# EAGLE design rc2014_8085 (EAGLE 8.1.1)
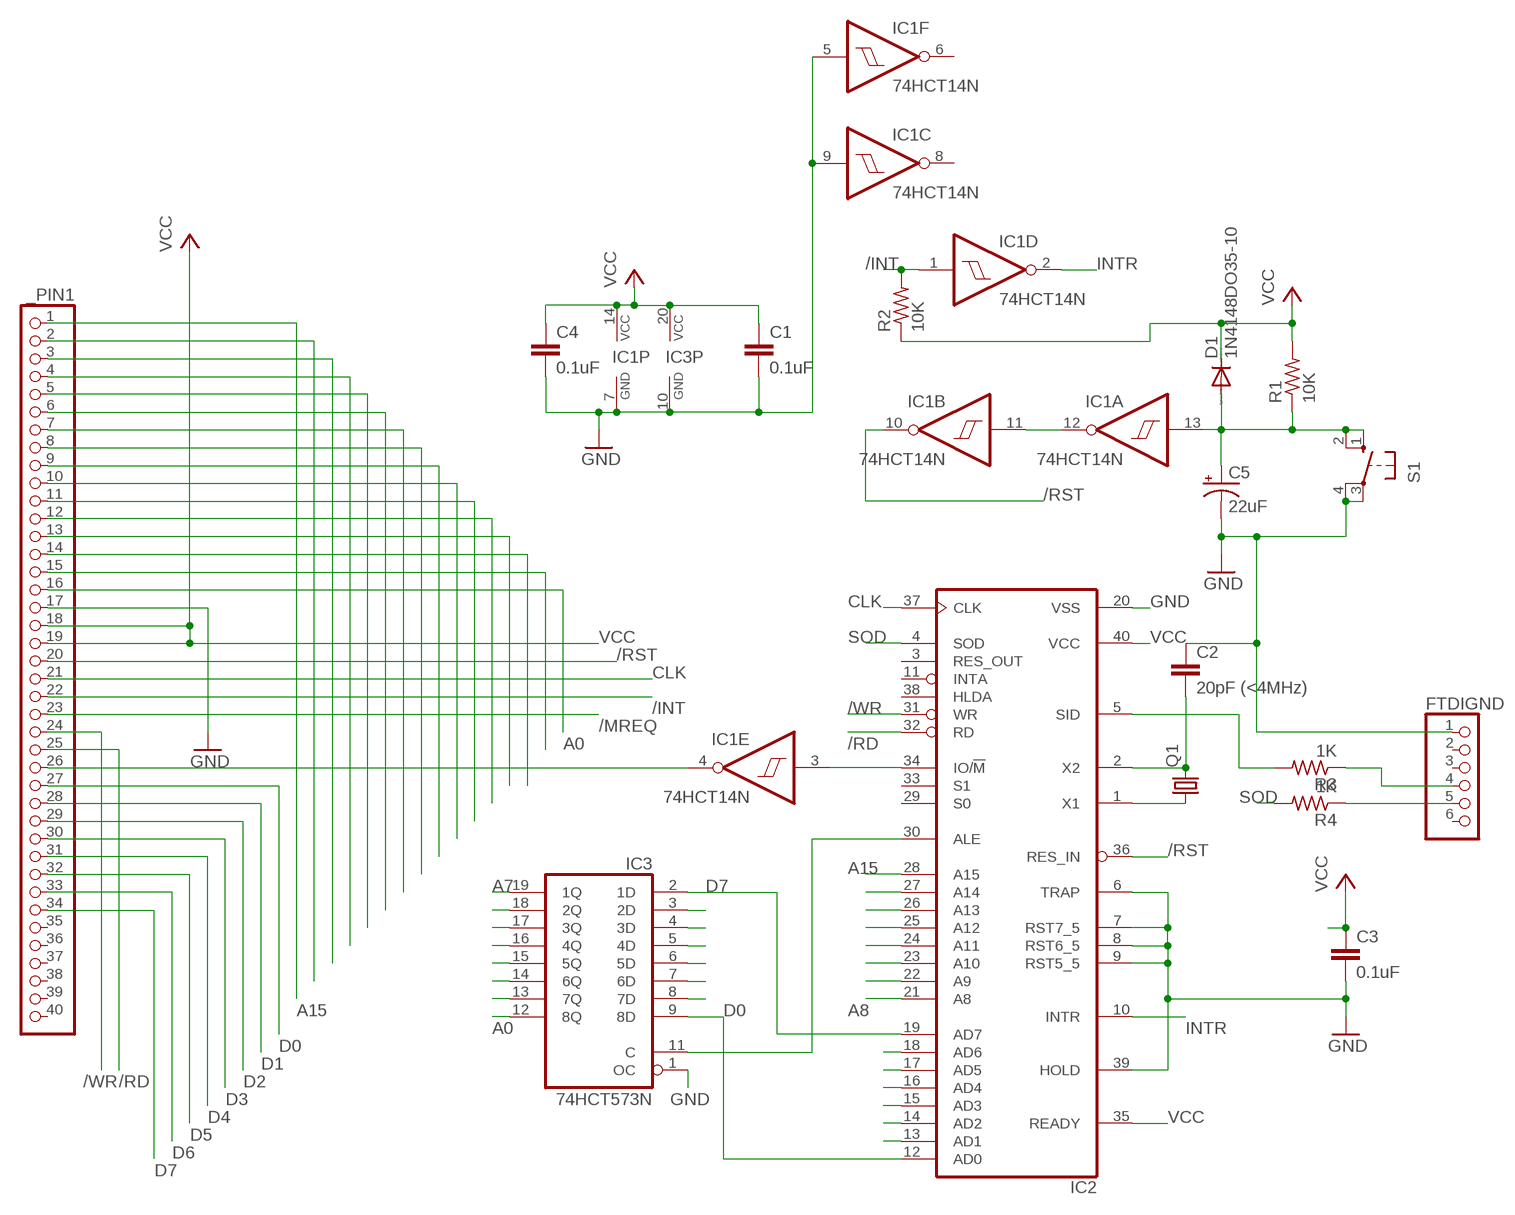
[diagram p0: schematic, sheet 1]

## Parts
_PIN1  PINHD-1X40  [1X40]
C1  0.1uF  C-EU050-024X044  [C050-024X044]
C2  20pF (<4MHz)  C-EU050-024X044  [C050-024X044]
C3  0.1uF  C-EU050-024X044  [C050-024X044]
C4  0.1uF  C-EU050-024X044  [C050-024X044]
C5  22uF  CPOL-USTAP5-80  [TAP5-80]
D1  1N4148DO35-10  [DO35-10]
FTDIGND  PINHD-1X6  [1X06]
IC1  74HCT14N  [DIL14]
IC2  8085  [DIL40]
IC3  74HCT573N  [DIL20]
Q1  CRYSTALHC49S  [HC49/S]
R1  10K  R-US_0207/10  [0207/10]
R2  10K  R-US_0207/10  [0207/10]
R3  1K  R-US_0207/10  [0207/10]
R4  1K  R-US_0207/10  [0207/10]
S1  10-XX  [B3F-10XX]

## Nets
/INT: _PIN1.22 IC1.1(D:I) R2.2
/IORQ: _PIN1.26 IC1.4(E:O)
/MREQ: _PIN1.23 IC1.3(E:I) IC2.34(IO/!M)
/RD: _PIN1.25 IC2.32(RD)
/RST: _PIN1.20 IC1.10(B:O) IC2.36(RES_IN)
/WR: _PIN1.24 IC2.31(WR)
A0: _PIN1.16 IC3.12(8Q)
A1: _PIN1.15 IC3.13(7Q)
A2: _PIN1.14 IC3.14(6Q)
A3: _PIN1.13 IC3.15(5Q)
A4: _PIN1.12 IC3.16(4Q)
A5: _PIN1.11 IC3.17(3Q)
A6: _PIN1.10 IC3.18(2Q)
A7: _PIN1.9 IC3.19(1Q)
A8: _PIN1.8 IC2.21(A8)
A9: _PIN1.7 IC2.22(A9)
A10: _PIN1.6 IC2.23(A10)
A11: _PIN1.5 IC2.24(A11)
A12: _PIN1.4 IC2.25(A12)
A13: _PIN1.3 IC2.26(A13)
A14: _PIN1.2 IC2.27(A14)
A15: _PIN1.1 IC2.28(A15)
ALE: IC2.30(ALE) IC3.11(C)
CLK: _PIN1.21 IC2.37(CLK)
D0: _PIN1.27 IC2.12(AD0) IC3.9(8D)
D1: _PIN1.28 IC2.13(AD1) IC3.8(7D)
D2: _PIN1.29 IC2.14(AD2) IC3.7(6D)
D3: _PIN1.30 IC2.15(AD3) IC3.6(5D)
D4: _PIN1.31 IC2.16(AD4) IC3.5(4D)
D5: _PIN1.32 IC2.17(AD5) IC3.4(3D)
D6: _PIN1.33 IC2.18(AD6) IC3.3(2D)
D7: _PIN1.34 IC2.19(AD7) IC3.2(1D)
GND: _PIN1.17 C1.2 C2.1 C3.2 C4.2 C5.- FTDIGND.1 IC1.5(F:I) IC1.7(P:GND) IC1.9(C:I) IC2.6(TRAP) IC2.7(RST7_5) IC2.8(RST6_5) IC2.9(RST5_5) IC2.20(VSS) IC2.39(HOLD) IC3.1(OC) IC3.10(GND) S1.3(P) S1.4(P1)
INTR: IC1.2(D:O) IC2.10(INTR)
N$5: IC2.1(X1) Q1.1
N$6: C2.2 IC2.2(X2) Q1.2
N$15: IC1.11(B:I) IC1.12(A:O)
RESET: C5.+ D1.A IC1.13(A:I) R1.1 S1.1(S) S1.2(S1)
RX: FTDIGND.4 R3.1
SID: IC2.5(SID) R3.2
SOD: IC2.4(SOD) R4.2
TX: FTDIGND.5 R4.1
VCC: _PIN1.18 _PIN1.19 C1.1 C3.1 C4.1 D1.C IC1.14(P:VCC) IC2.35(READY) IC2.40(VCC) IC3.20(VCC) R1.2 R2.1
Unconnected: _PIN1.35 _PIN1.36 _PIN1.37 _PIN1.38 _PIN1.39 _PIN1.40 FTDIGND.2 FTDIGND.3 FTDIGND.6 IC1.6(F:O) IC1.8(C:O) IC2.3(RES_OUT) IC2.11(INTA) IC2.29(S0) IC2.33(S1) IC2.38(HLDA)

## Library data of the parts
_PIN1 = pinhead:PINHD-1X40: PIN HEADER
C1-C4 = rcl:C-EU: CAPACITOR, European symbol
C5 = rcl:CPOL-US: POLARIZED CAPACITOR, American symbol
D1 = diode:1N4148: DIODE high speed (Philips)
FTDIGND = pinhead:PINHD-1X6: PIN HEADER
IC1 = 74xx-eu:74*14: Hex schmitt trigger INVERTER
IC2 = micro-intel:8085: MICROCOMPUTER/PERIPHERAL DEVICE; OC_FARNELL: unknown; OC_NEWARK: unknown
IC3 = 74xx-eu:74*573: 8-bit D latch BUS DRIVER
Q1 = crystal:CRYSTAL: CRYSTAL; OC_FARNELL: 1667008; OC_NEWARK: unknown
R1-R4 = rcl:R-US_: RESISTOR, American symbol
S1 = switch-omron:10-XX: OMRON SWITCH; MPN: B3F-1000; OC_FARNELL: 176432; OC_NEWARK: 36M3542

## Net classes
0 +5V: width 0.508 mm

## Board
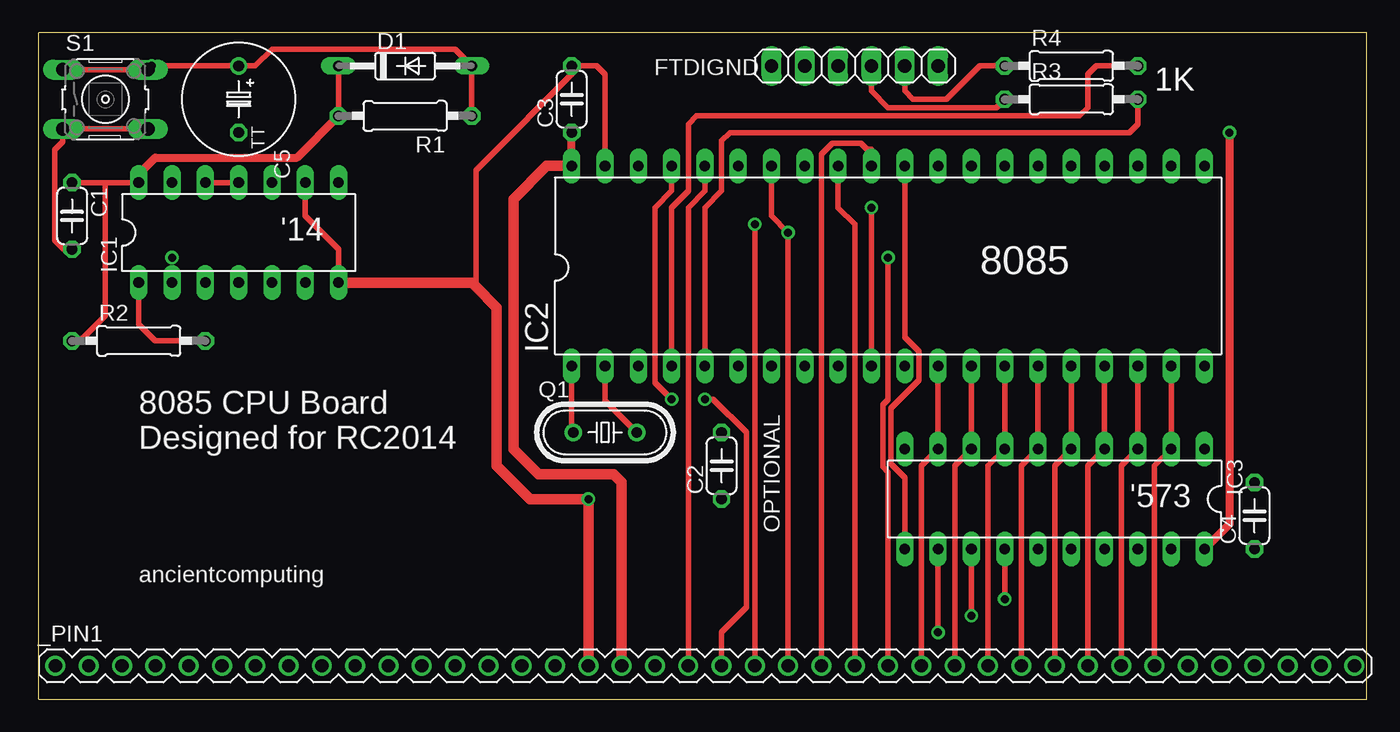
[diagram p1: board, top side]
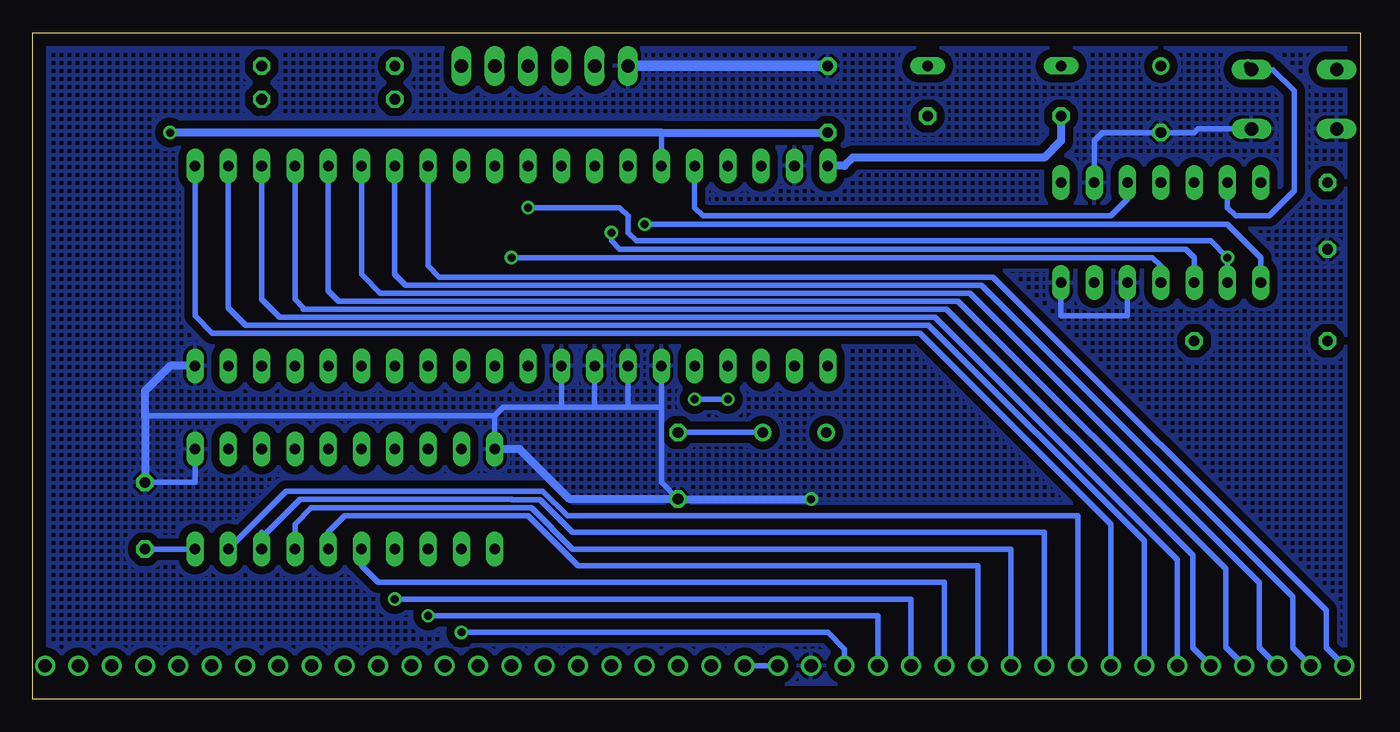
[diagram p2: board, bottom side, seen from below]

Size 101.27 x 50.79 mm. Coordinates in mm from the lower left corner, seen from the top.
Outline: 0,0 101.27,0 101.27,50.79 0,50.79 0,0
Copper layers (1*16): Top 0.035mm / dielectric 1.5mm / Bottom 0.035mm
Design rules "default *": minimum track width 20mil, minimum drill 24mil, track to track 8mil, track to pad 8mil, pad to pad 8mil, via to via 8mil, smd to smd 8mil, copper to edge 40mil, drill to drill 8mil, minimum pad ring 10mil, minimum via ring 8mil, stop-mask expansion 4mil, vias tented up to drill 0mil, thermal gap 10mil

### Footprints (pad centres in the part's own frame; a part is rotated, then mirrored left to right if it is on the bottom)
1X40 = drill 1.016: 1 -49.53,0; 2 -46.99,0; 3 -44.45,0; 4 -41.91,0; 5 -39.37,0; 6 -36.83,0; 7 -34.29,0; 8 -31.75,0; 9 -29.21,0; 10 -26.67,0; 11 -24.13,0; 12 -21.59,0; 13 -19.05,0; 14 -16.51,0; 15 -13.97,0; 16 -11.43,0; 17 -8.89,0; 18 -6.35,0; 19 -3.81,0; 20 -1.27,0; 21 1.27,0; 22 3.81,0; 23 6.35,0; 24 8.89,0; 25 11.43,0; 26 13.97,0; 27 16.51,0; 28 19.05,0; 29 21.59,0; 30 24.13,0; 31 26.67,0; 32 29.21,0; 33 31.75,0; 34 34.29,0; 35 36.83,0; 36 39.37,0; 37 41.91,0; 38 44.45,0; 39 46.99,0; 40 49.53,0
C050-024X044 = drill 0.813 octagon: 1 -2.54,0; 2 2.54,0
TAP5-80 = drill 0.813: + -2.54,0 | drill 0.813 octagon: - 2.54,0
DO35-10 = drill 0.813 long: A 5.08,0; C -5.08,0
1X06 = drill 1.016 long: 1 -6.35,0; 2 -3.81,0; 3 -1.27,0; 4 1.27,0; 5 3.81,0; 6 6.35,0
DIL14 = drill 0.813 long: 1 -7.62,-3.81; 2 -5.08,-3.81; 3 -2.54,-3.81; 4 0,-3.81; 5 2.54,-3.81; 6 5.08,-3.81; 7 7.62,-3.81; 8 7.62,3.81; 9 5.08,3.81; 10 2.54,3.81; 11 0,3.81; 12 -2.54,3.81; 13 -5.08,3.81; 14 -7.62,3.81
DIL40 = drill 0.813 long: 1 -24.13,-7.62; 2 -21.59,-7.62; 3 -19.05,-7.62; 4 -16.51,-7.62; 5 -13.97,-7.62; 6 -11.43,-7.62; 7 -8.89,-7.62; 8 -6.35,-7.62; 9 -3.81,-7.62; 10 -1.27,-7.62; 11 1.27,-7.62; 12 3.81,-7.62; 13 6.35,-7.62; 14 8.89,-7.62; 15 11.43,-7.62; 16 13.97,-7.62; 17 16.51,-7.62; 18 19.05,-7.62; 19 21.59,-7.62; 20 24.13,-7.62; 21 24.13,7.62; 22 21.59,7.62; 23 19.05,7.62; 24 16.51,7.62; 25 13.97,7.62; 26 11.43,7.62; 27 8.89,7.62; 28 6.35,7.62; 29 3.81,7.62; 30 1.27,7.62; 31 -1.27,7.62; 32 -3.81,7.62; 33 -6.35,7.62; 34 -8.89,7.62; 35 -11.43,7.62; 36 -13.97,7.62; 37 -16.51,7.62; 38 -19.05,7.62; 39 -21.59,7.62; 40 -24.13,7.62
DIL20 = drill 0.813 long: 1 -11.43,-3.81; 2 -8.89,-3.81; 3 -6.35,-3.81; 4 -3.81,-3.81; 5 -1.27,-3.81; 6 1.27,-3.81; 7 3.81,-3.81; 8 6.35,-3.81; 9 8.89,-3.81; 10 11.43,-3.81; 11 11.43,3.81; 12 8.89,3.81; 13 6.35,3.81; 14 3.81,3.81; 15 1.27,3.81; 16 -1.27,3.81; 17 -3.81,3.81; 18 -6.35,3.81; 19 -8.89,3.81; 20 -11.43,3.81
HC49/S = drill 0.813: 1 -2.413,0; 2 2.413,0
0207/10 = drill 0.813 octagon: 1 -5.08,0; 2 5.08,0
B3F-10XX = drill 1.016 long: 1 -3.251,2.261; 2 3.251,2.261; 3 -3.251,-2.261; 4 3.251,-2.261

### Placement (x,y rotation side)
_PIN1  50.8,2.54 0 top
C1  2.54,36.83 270 top
C2  0.1uF  [C050-024X044]  52.07,17.78 90 top
C3  40.64,45.72 90 top
C4  92.71,13.97 90 top
C5  15.24,45.72 270 top
D1  27.94,48.26 0 top
FTDIGND  62.23,48.26 0 top
IC1  15.24,35.56 0 top
IC2  64.77,33.02 0 top
IC3  77.47,15.24 180 top
Q1  43.18,20.32 0 top
R1  27.94,44.45 180 top
R2  7.62,27.3 0 top
R3  78.74,45.72 0 top
R4  78.74,48.26 0 top
S1  5.08,45.72 0 top

### Tracks (layer width: path | path; a pad name or v marks a point on that pad's centre or on a via)
/INT  (via drill 0.61)
  Top 0.406: _PIN1.22 v54.61,36.2 | IC1.1 7.62,28.57 8.89,27.3 R2.2
  Bottom 0.406: v54.61,36.2 10.16,36.2 7.62,33.66 IC1.1
/IORQ  (via drill 0.61)
  Top 0.406: _PIN1.26 64.77,17.29 64.36,17.7 64.36,22.42 64.77,22.82 v64.77,33.66
  Bottom 0.406: IC1.4 15.24,33.02 15.88,33.66 v64.77,33.66
/MREQ  (via drill 0.61)
  Top 0.406: _PIN1.23 v57.15,35.56 55.88,36.83 IC2.34
  Bottom 0.406: IC1.3 12.7,33.66 13.34,34.29 56.52,34.29 57.15,34.92 v57.15,35.56
/RD
  Top 0.406: _PIN1.25 62.23,36.2 60.96,37.47 IC2.32
/RST
  Top 0.406: _PIN1.20 49.53,37.47 50.8,38.73 IC2.36
  Bottom 0.406: IC1.10 17.78,38.1 19.05,36.83 50.16,36.83 50.8,37.47 IC2.36
/WR
  Top 0.406: _PIN1.24 59.69,41.54 60.52,42.37 62.69,42.37 63.14,41.91 63.5,41.91 IC2.31
A0  (via drill 0.61)
  Top 0.406: v68.58,5.08 IC3.12
  Bottom 0.406: v68.58,5.08 40.64,5.08 39.37,3.81 _PIN1.16
A1  (via drill 0.61)
  Top 0.406: v71.12,6.35 IC3.13
  Bottom 0.406: v71.12,6.35 36.83,6.35 _PIN1.15
A2  (via drill 0.61)
  Top 0.406: v73.66,7.62 IC3.14
  Bottom 0.406: v73.66,7.62 34.29,7.62 _PIN1.14
A3
  Bottom 0.406: IC3.15 76.2,10.16 74.93,8.89 31.75,8.89 _PIN1.13
A4
  Bottom 0.406: IC3.16 78.74,12.7 77.47,13.97 63.5,13.97 59.69,10.16 29.21,10.16 _PIN1.12
A5
  Bottom 0.406: IC3.17 81.28,13.34 80.03,14.58 63.25,14.58 60.1,11.43 26.67,11.43 _PIN1.11
A6
  Bottom 0.406: _PIN1.10 24.13,12.7 60.1,12.7 62.59,15.19 64.72,15.19 64.77,15.24 80.87,15.24 83.82,12.29 IC3.18 83.82,12.7
A7
  Bottom 0.406: IC3.19 81.94,15.85 62.38,15.85 60.51,13.97 21.59,13.97 _PIN1.9
A8
  Bottom 0.406: _PIN1.8 19.05,13.34 33.62,27.9 87.59,27.9 88.9,29.21 IC2.21
A9
  Bottom 0.406: _PIN1.7 16.51,12.06 32.95,28.51 85.03,28.51 86.36,29.84 IC2.22
A10
  Bottom 0.406: _PIN1.6 13.97,10.61 32.48,29.12 82.46,29.12 83.82,30.48 IC2.23
A11
  Bottom 0.406: IC2.24 81.28,30.48 80.64,29.84 80.64,29.73 31.59,29.73 12.8,10.94 12.8,3.91 _PIN1.5
A12
  Bottom 0.406: IC2.25 78.74,31.11 77.96,30.34 30.7,30.34 10.29,9.93 10.29,3.94 _PIN1.4
A13
  Bottom 0.406: _PIN1.3 7.72,3.91 7.72,8.86 29.81,30.95 74.76,30.95 76.2,32.38 IC2.26
A14
  Bottom 0.406: _PIN1.2 5.18,3.91 5.18,7.81 28.93,31.56 72.83,31.56 73.66,32.38 IC2.27
A15
  Bottom 0.406: _PIN1.1 2.64,3.91 2.64,6.77 28.04,32.17 70.27,32.17 71.12,33.02 IC2.28
ALE
  Top 0.406: IC3.11 66.04,16.88 64.97,17.95 64.97,22.16 67.11,24.3 67.11,26.5 66.04,27.57 IC2.30
CLK  (via drill 0.61)
  Top 0.406: IC2.37 48.26,38.73 46.99,37.47 46.99,24.13 v48.26,22.86 | v50.8,22.86 51.44,22.86 53.98,20.32 53.98,6.99 52.07,5.08 _PIN1.21
  Bottom 0.406: v48.26,22.86 v50.8,22.86
D0
  Top 0.406: _PIN1.27 67.31,17.78 IC3.9 IC2.12
D1
  Top 0.406: _PIN1.28 69.85,17.78 IC3.8 IC2.13
D2
  Top 0.406: _PIN1.29 72.39,17.78 IC3.7 IC2.14
D3
  Top 0.406: _PIN1.30 74.93,17.78 IC3.6 IC2.15
D4
  Top 0.406: _PIN1.31 77.47,17.78 IC3.5 IC2.16
D5
  Top 0.406: _PIN1.32 80.01,17.78 IC3.4 IC2.17
D6
  Top 0.406: _PIN1.33 82.55,17.78 IC3.3 IC2.18
D7
  Top 0.406: _PIN1.34 85.09,17.78 IC3.2 IC2.19
GND  (via drill 0.61)
  Top 0.406: S1.4 S1.3 1.83,42.47 1.22,41.86 1.22,34.98 1.91,34.29 C1.2 | IC2.39 43.18,47.62 42.55,48.26 41.27,48.26 | 41.27,48.26 C3.2 | IC1.9 20.32,36.83 22.86,34.29 IC1.7 | 33.34,31.43 33.34,40.32 41.27,48.26
  Top 0.813: _PIN1.17 v41.91,15.24 37.47,15.24 34.92,17.78 34.92,29.84 33.34,31.43 33.02,31.75 IC1.7
  Bottom 0.406: S1.4 12.42,43.46 12.7,43.18 C5.- 19.68,43.18 20.32,42.55 IC1.9 | C4.2 88.9,16.51 IC3.1 | IC2.6 53.34,22.23 | 55.88,22.23 58.42,22.23 | 55.88,22.23 53.34,22.23 | 60.96,22.23 58.42,22.23 | 60.96,22.23 IC2.9 | IC2.8 58.42,22.23 | IC2.7 55.88,22.23 | 66.04,21.59 65.41,22.23 60.96,22.23 | IC3.10 66.04,21.59 | 66.04,21.59 92.71,21.59 | 53.34,22.23 53.34,16.51 C2.1 | IC1.5 17.78,29.21 22.86,29.21 IC1.7
  Bottom 0.61: v41.91,15.24 C2.1 60.33,15.24 64.14,19.05 IC3.10 | IC2.20 90.81,25.4 92.71,23.5 92.71,21.59 C4.2
  Bottom 0.813: FTDIGND.1 C3.2
  pour Bottom (isolate 0.61, hatched): 0,50.8 0,0 101.6,0 101.6,50.8
INTR  (via drill 0.61)
  Top 0.406: IC2.10 v63.5,37.47
  Bottom 0.406: IC1.2 v10.16,33.66 11.43,34.92 55.24,34.92 55.88,35.56 55.88,36.78 55.86,36.81 56.52,37.47 v63.5,37.47
N$5
  Top 0.406: IC2.1 40.64,20.45 Q1.1
N$6
  Top 0.406: Q1.2 43.18,22.73 IC2.2
  Bottom 0.406: Q1.2 C2.2
N$15
  Top 0.406: IC1.12 IC1.11
RESET  (via drill 0.61)
  Top 0.406: v8.61,48.26 C5.+ 16.51,48.26 17.78,49.53 31.75,49.53 D1.A R1.1 | S1.2 S1.1
  Bottom 0.406: v8.61,48.26 S1.2 6.71,47.98 5.08,46.35 5.08,38.73 6.99,36.83 9.53,36.83 10.16,37.47 IC1.13
RX
  Top 0.406: FTDIGND.4 63.5,46.35 64.77,45.09 73.03,45.09 R3.1
SID
  Top 0.406: IC2.5 50.8,37.47 52.07,38.73 52.07,42.55 52.7,43.18 83.19,43.18 83.82,43.81 R3.2
SOD
  Top 0.406: IC2.4 48.26,37.47 49.53,38.73 49.53,43.81 50.16,44.45 79.38,44.45 80.01,45.09 80.01,47.62 80.64,48.26 R4.2
TX
  Top 0.406: R4.1 71.75,48.26 69.22,45.72 66.67,45.72 66.04,46.35 FTDIGND.5
VCC  (via drill 0.61)
  Top 0.406: R1.2 D1.C | 5.08,39.37 IC1.14 | 5.08,39.37 C1.1 | R2.1 3.17,27.3 5.08,29.21 5.08,39.37
  Top 0.61: IC2.40 C3.1 | v90.81,43.18 90.81,13.34 IC3.20 | IC1.14 7.62,40.01 8.89,41.27 19.68,41.27 R1.2
  Top 0.813: _PIN1.18 44.45,16.51 43.81,17.14 38.1,17.14 36.2,19.05 36.2,38.1 38.73,40.64 IC2.40
  Bottom 0.406: IC3.20 C4.1 | IC2.35 53.34,43.18 | _PIN1.19 _PIN1.18
  Bottom 0.61: IC1.14 7.62,40.01 | C3.1 53.34,43.18 v90.81,43.18 | R1.2 22.86,42.55 24.13,41.27 38.73,41.27 39.37,40.64 IC2.40

### Text on the board
tNames: 1K | '14 | 8085 | 8085 CPU Board / Designed for RC2014 | '573 | OPTIONAL | ancientcomputing